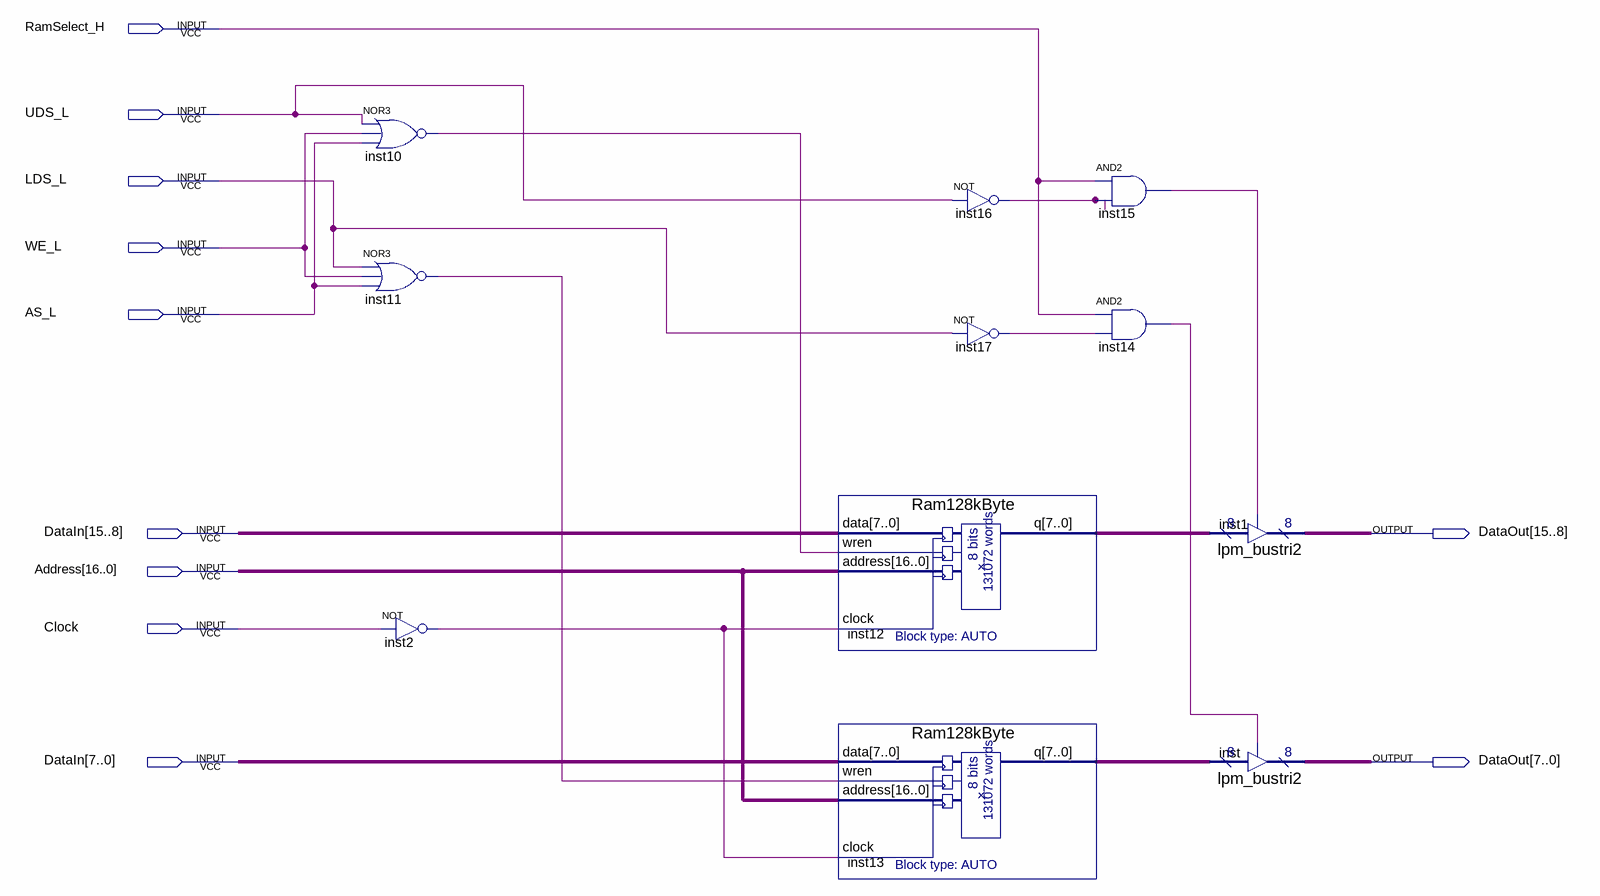
[diagram p0: schematic sheet]
// Quartus schematic OnChipRam256kbyte.bdf as structural Verilog: 11 symbols, 11 pins
module OnChipRam256kbyte (
  input  RamSelect_H,
  input  UDS_L,
  input  LDS_L,
  input  WE_L,
  input  AS_L,
  input  [15:0] DataIn,
  input  [16:0] Address,
  input  Clock,
  output [15:0] DataOut
);

  wire inst2_out, inst10_out, inst11_out, inst14_out, inst15_out, inst16_out, inst17_out;
  wire [7:0] inst12_q, inst13_q;

  nor inst10 (inst10_out, UDS_L, WE_L, AS_L);
  nor inst11 (inst11_out, LDS_L, WE_L, AS_L);
  not inst2 (inst2_out, Clock);
  Ram128kByte inst12 (.data(DataIn[15:8]), .wren(inst10_out), .address(Address), .clock(inst2_out), .q(inst12_q));
  Ram128kByte inst13 (.data(DataIn[7:0]), .wren(inst11_out), .address(Address), .clock(inst2_out), .q(inst13_q));
  not inst16 (inst16_out, UDS_L);
  not inst17 (inst17_out, LDS_L);
  and inst15 (inst15_out, RamSelect_H, inst16_out);
  and inst14 (inst14_out, RamSelect_H, inst17_out);
  lpm_bustri2 inst1 (.enabledt(inst15_out), .data(inst12_q), .tridata(DataOut[15:8]));
  lpm_bustri2 inst (.enabledt(inst14_out), .data(inst13_q), .tridata(DataOut[7:0]));
endmodule
